# Altium schematic sheet Micro_Clock.SchDoc
size B
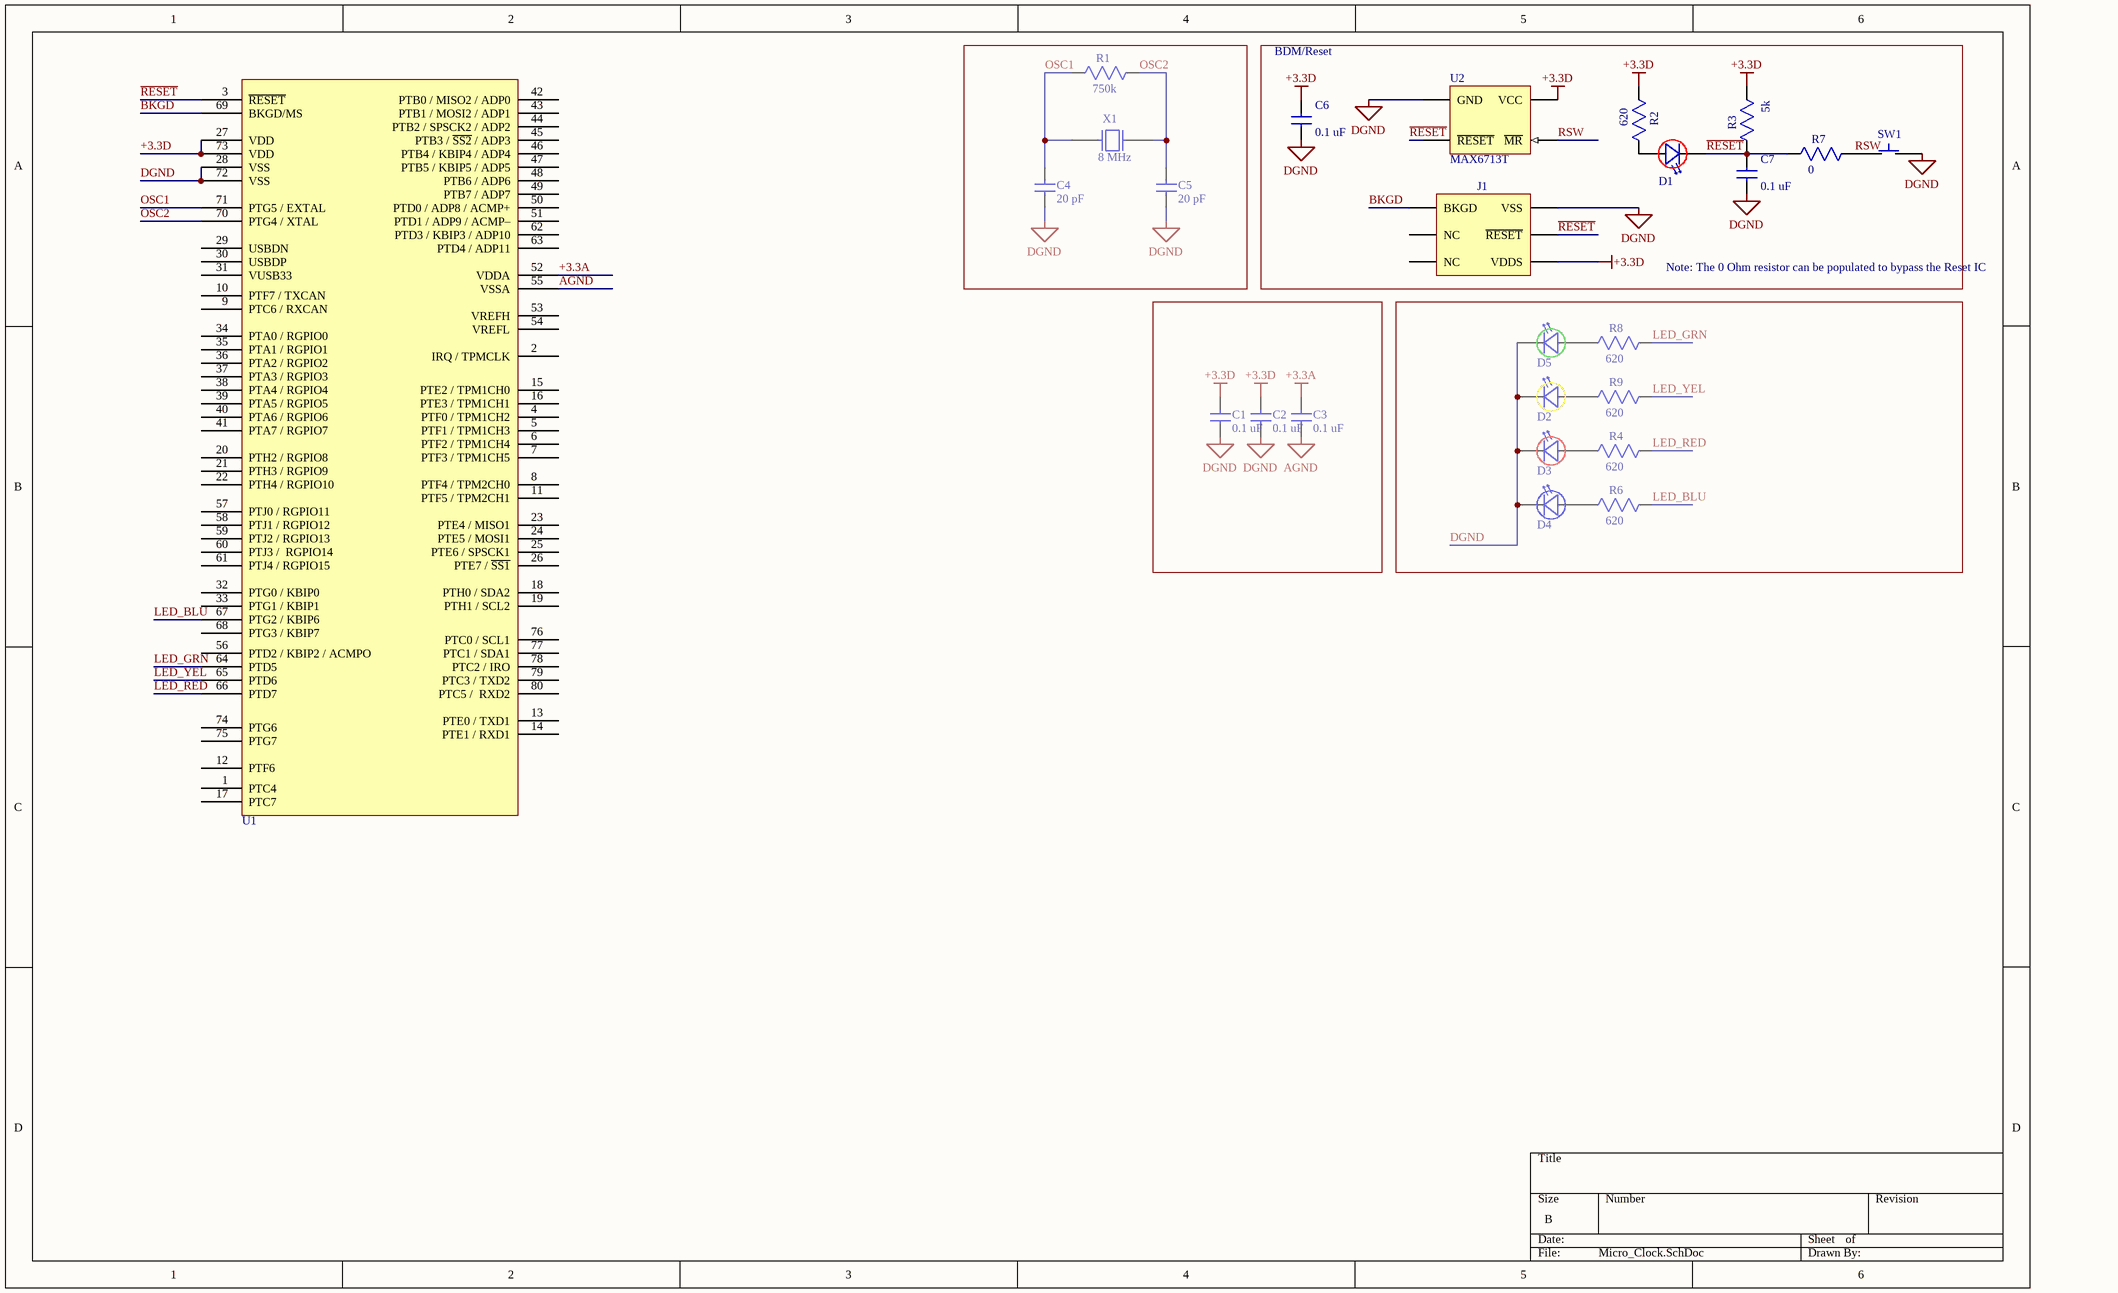
[diagram p0: Micro_Clock.SchDoc]

## Parts
C1  value 0.1 uF  [0805]  (hidden comment: CAP 0.1uF)
C2  value 0.1 uF  [0805]  (hidden comment: CAP 0.1uF)
C3  value 0.1 uF  [0805]  (hidden comment: CAP 0.1uF)
C4  value 20 pF  [0805]  (hidden comment: CAP 20PF)
C5  value 20 pF  [0805]  (hidden comment: CAP 20PF)
C6  value 0.1 uF  [0805]  (hidden comment: CAP 0.1uF)
C7  value 0.1 uF  [0805]  (hidden comment: CAP 0.1uF)
D1  D_LED_0805_RED  [0805P]  (value not drawn)
D2  D_LED_0805_YELLOW  [0805P]  (value not drawn)
D3  D_LED_0805_RED  [0805P]  (value not drawn)
D4  D_LED_0805_BLUE  [0805P]  (value not drawn)
D5  D_LED_0805_GREEN  [0805P]  (value not drawn)
J1  BDM HHEADER  [BDM_HEADER]  (value not drawn)
R1  value 750k  [0805]  (hidden comment: R_0805_750k_1%)
R2  value 620  [0805]  (hidden comment: R_0805_620_1%)
R3  value 5k  [0805]  (hidden comment: R_0805_5k)
R4  value 620  [0805]  (hidden comment: R_0805_620_1%)
R6  value 620  [0805]  (hidden comment: R_0805_620_1%)
R7  value 0  [0805]  (hidden comment: R_0805_0)
R8  value 620  [0805]  (hidden comment: R_0805_620_1%)
R9  value 620  [0805]  (hidden comment: R_0805_620_1%)
SW1  SW_TACT_SWITCH_6x6  [TACT_SWITCH_6x6]  (value not drawn)
U1  C3 Microcontroller  [QFN_80_65P]  (value not drawn)
U2  value MAX6713T  [SC70]  (hidden comment: U_MAX6713T)
X1  value 8 MHz  [HC-49]  (hidden comment: HC49)

## Blocks framed on the sheet
BDM/Reset: C6 C7 D1 J1 R2 R3 R7 SW1 U2

## Nets
+3.3A: C3.2 U1.52(VDDA)
+3.3D: C1.2 C2.1 C6.2 J1.4(VDDS) R2.2 R3.1 U1.27(VDD) U1.73(VDD) U2.4(VCC)
AGND: C3.1 U1.55(VSSA)
DGND: C1.1 C2.2 C4.2 C5.2 C6.1 C7.1 D2.1(Cathode) D3.1(Cathode) D4.1(Cathode) D5.1(Cathode) J1.6(VSS) SW1.2 U1.28(VSS) U1.72(VSS) U2.1(GND)
BKGD: J1.1(BKGD) U1.69(BKGD/MS)
LED_BLU: R6.1 U1.67(PTG2_/_KBIP6)
LED_GRN: R8.1 U1.64(PTD5)
LED_RED: R4.1 U1.66(PTD7)
LED_YEL: R9.1 U1.65(PTD6)
OSC1: C4.1 R1.2 U1.71(PTG5_/_EXTAL) X1.2
OSC2: C5.1 R1.1 U1.70(PTG4_/_XTAL) X1.1
~{RESET}: C7.2 D1.1(Cathode) J1.5(~{RESET}) R3.2 R7.2 U1.3(~{RESET}) U2.2(~{RESET})
RSW: R7.1 SW1.1 U2.3(~{MR})
NetD1_2: D1.2(Anode) R2.1
NetD2_2: D2.2(Anode) R9.2
NetD3_2: D3.2(Anode) R4.2
NetD4_2: D4.2(Anode) R6.2
NetD5_2: D5.2(Anode) R8.2

Not connected (* = marked no-connect by the designer): J1 2(NC) 3(NC); U1 1(PTC4) 2(IRQ_/_TPMCLK) 4(PTF0_/_TPM1CH2) 5(PTF1_/_TPM1CH3) 6(PTF2_/_TPM1CH4) 7(PTF3_/_TPM1CH5) 8(PTF4_/_TPM2CH0) 9(PTC6_/_RXCAN) 10(PTF7_/_TXCAN) 11(PTF5_/_TPM2CH1) 12(PTF6) 13(PTE0_/_TXD1) 14(PTE1_/_RXD1) 15(PTE2_/_TPM1CH0) 16(PTE3_/_TPM1CH1) 17(PTC7) 18(PTH0_/_SDA2) 19(PTH1_/_SCL2) 20(PTH2_/_RGPIO8) 21(PTH3_/_RGPIO9) 22(PTH4_/_RGPIO10) 23(PTE4_/_MISO1) 24(PTE5_/_MOSI1) 25(PTE6_/_SPSCK1) 26(PTE7_/_~{SS1}) 29(USBDN) 30(USBDP) 31(VUSB33) 32(PTG0_/_KBIP0) 33(PTG1_/_KBIP1) 34(PTA0_/_RGPIO0) 35(PTA1_/_RGPIO1) 36(PTA2_/_RGPIO2) 37(PTA3_/_RGPIO3) 38(PTA4_/_RGPIO4) 39(PTA5_/_RGPIO5) 40(PTA6_/_RGPIO6) 41(PTA7_/_RGPIO7) 42(PTB0_/_MISO2_/_ADP0) 43(PTB1_/_MOSI2_/_ADP1) 44(PTB2_/_SPSCK2_/_ADP2) 45(PTB3_/_~{SS2}_/_ADP3) 46(PTB4_/_KBIP4_/_ADP4) 47(PTB5_/_KBIP5_/_ADP5) 48(PTB6_/_ADP6) 49(PTB7_/_ADP7) 50(PTD0_/_ADP8_/_ACMP+) 51(PTD1_/_ADP9_/_ACMP–) 53(VREFH) 54(VREFL) 56(PTD2_/_KBIP2_/_ACMPO) 57(PTJ0_/_RGPIO11) 58(PTJ1_/_RGPIO12) 59(PTJ2_/_RGPIO13) 60(PTJ3_/__RGPIO14) 61(PTJ4_/_RGPIO15) 62(PTD3_/_KBIP3_/_ADP10) 63(PTD4_/_ADP11) 68(PTG3_/_KBIP7) 74(PTG6) 75(PTG7) 76(PTC0_/_SCL1) 77(PTC1_/_SDA1) 78(PTC2_/_IRO) 79(PTC3_/_TXD2) 80(PTC5_/__RXD2)

## Notes on the sheet
- Note: The 0 Ohm resistor can be populated to bypass the Reset IC

## Library data of the parts
C1-C3 C6 C7 = C_0805_0.1uF_1: CAP CERM 0.1uF; Manufacturer: Yageo; Manufacturer PN: CC0805ZRY5V9BB104; SVP Creator: Brett Paulsen; Package: 0805; Known Distributors: Digikey; ComponentLink1Description: Datasheet; ComponentLink1URL: SVN Datasheet URL; Price: .028
C4 C5 = C_0805_20PF_100V_5%: CAP CERM 20PF 5% 100V NP0 0805; Manufacturer: AVX; Manufacturer PN: 08051A200JAT2A; SVP Creator: Jonathan Nutzmann; Package: 0805; Known Distributors: Digikey; ComponentLink1Description: Datasheet; ComponentLink1URL: SVN Datasheet URL; Price: 0.231
D1 D3 = D_LED_0805_RED: LED CHIPLED 645NM RED DIFF 0805; SVP Creator: Jonathan Nutzmann; Current: 20mA; Forward Voltage: 1.8; Package: 0805; Known Distributors: Digikey; Value: RED; ComponentLink1Description: Datasheet
D2 = D_LED_0805_YELLOW: LED 595NM AMBER DIFF SMD 0805; SVP Creator: Jonathan Nutzmann; Current: 20mA; Forward Voltage: 1.9; Value: YELLOW; Package: 0805; Known Distributors: Digikey; ComponentLink1Description: Datasheet
D4 = D_LED_0805_BLUE: LED 2X1.2MM 470NM BL WTR CLR SMD; SVP Creator: Jonathan Nutzmann; Current: 20mA; Forward Voltage: 3.3; Value: RED; Package: 0805; Known Distributors: Digikey; ComponentLink1Description: Datasheet
D5 = D_LED_0805_GREEN: LED CHIPLED 570NM GREEN 0805 SMD; Manufacturer: Osram Opto Semiconductors Inc; Manufacturer PN: LG R971-KN-1-0-20-R18; SVP Creator: Nate Bolyard; SVP Reviewer 1: Trevtron; Current: 20mA; Forward Voltage: 2.2V; Package: 0805; Known Distributors: Digikey; Value: GREEN; HelpURL: http://umnsvp.dyndns.org/svn/centaurus2/datasheets/common parts/LG_R971.pdf; ComponentLink1URL: http://umnsvp.dyndns.org/svn/centaurus2/datasheets/common parts/LG_R971.pdf; ComponentLink1Description: Datasheet
J1 = J_BDM_HEADER: BDM HEADER; Manufacurer: 3M; Manufacurer_PN: 951206-8622-AR; SVP Creator: Nate Bolyard
R1 = R_0805_750k_1%: RES 750K OHM 1/8W 1% 0805 SMD; Manufacturer: Rohm Semiconductor; Manufacturer PN: RHM750KCRCT-ND; Power Rating: .125W; SVP Creator: Jonathan Nutzmann; Package: 0805; Known Distributor: Digikey; ComponentLink1Description: Datasheet
R2 R4 R6 R8 R9 = R_0805_620_1%: RES 620 OHM 1/8W 1% 0805 SMD; Power Rating: .125W; SVP Creator: Jonathan Nutzmann; Package: 0805; Known Distributor: Digikey; ComponentLink1Description: Datasheet
R3 = R_0805_5K_1%: RES 5K OHM 1/8W 1% 0805 SMD; Power Rating: .125W; SVP Creator: Jonathan Nutzmann; Package: 0805; Known Distributor: Digikey; ComponentLink1Description: Datasheet
R7 = R_0805_0: RES 0 OHM 0805 SMD; Power Rating: .125W; SVP Creator: Jonathan Nutzmann; Package: 0805; Known Distributor: Digikey; ComponentLink1Description: Datasheet
SW1 = SW_TACT_SWITCH_6x6: SWITCH TACT 6MM BLACK 160GF; Manufacturer: Tyco Electronics; Manufacturer PN: FSM4JH; SVP Creator: Nate Bolyard; Known Distributors: Digikey; Package: 6mm x 6mm
U1 = U_MCF51JM128VLK: IC MCU 128/16K FLASH/SRAM 80LQFP; Manufacturer: Microchip; Manufacturer PN: MCF51JM128VLK-ND; SVP Creator: Jonathan Nutzmann; Package: 80-LQFP; Known Distributors: Digikey; ComponentLink1Description: Datasheet; ComponentLink1URL: http://umnsvp.dyndns.org/svn/centaurus3/datasheets/CBSB/MCF51JM128RM.pdf; Price: 0.00
U2 = U_MAX6713T: MAX6713T Reset controller; Manufacturer: Maxim; Manufacturer PN: MAX6713TEXS+T; SVP Creator: Nate Bolyard; Package: SC70 - check this; Known Distributors: Digikey; ComponentLink1Description: Datasheet; ComponentLink1URL: http://umnsvp.dyndns.org/svn/centaurus2/datasheets/Common Board/MAX6711L-MAX6713Z.pdf; HelpURL: http://umnsvp.dyndns.org/svn/centaurus2/datasheets/Common Board/MAX6711L-MAX6713Z.pdf
X1 = X_HC49: CRYSTAL 8.00 MHZ 20PF 49US; Manufacturer: ECS; Manufacturer PN: ECS-80-20-4X; SVP Creator: Jonathan Nutzmann; Load Capacitance: 20pF; Known Distributor: Digikey; Package: HC49/US; ComponentLink1Description: Datasheet